# Altium schematic sheet Indication.SchDoc
size 420 x 297 mm; Address1: Address1; Address2: Address2; Address3: Address3; Address4: Address4; DocumentNumber: *Э3; SheetNumber: 7; SheetTotal: 10; DocumentType: Схема электрическая *
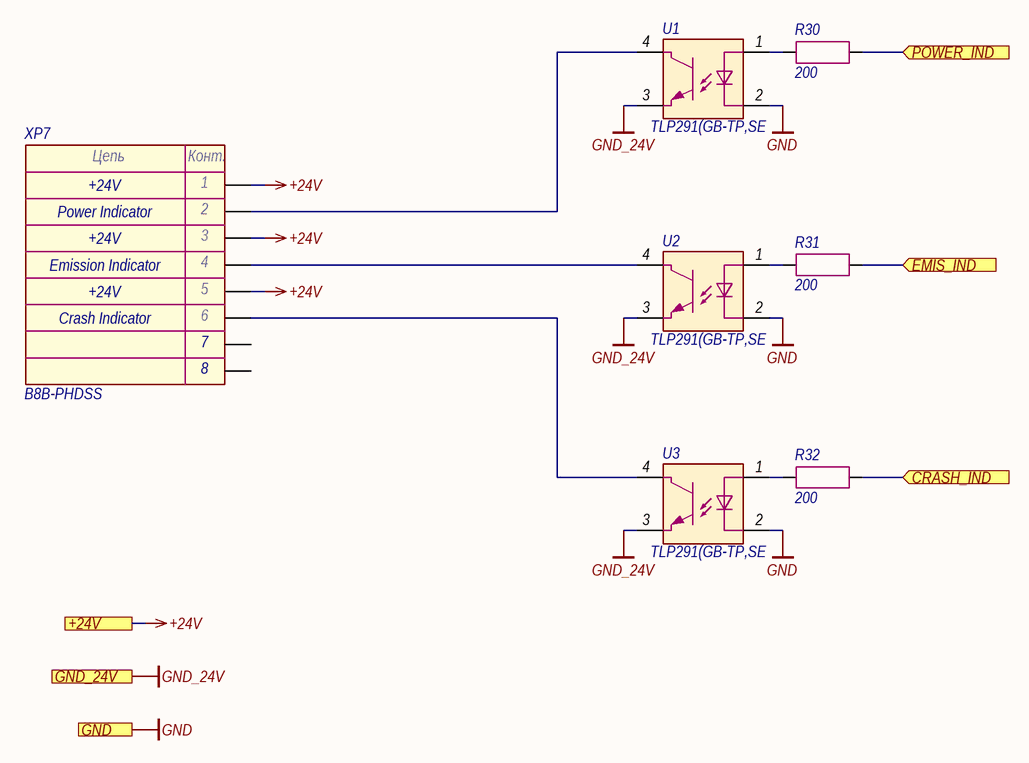
[diagram p0: Indication.SchDoc]

## Parts
R30  200  [RES_0603]
R31  200  [RES_0603]
R32  200  [RES_0603]
U1  TLP291(GB-TP,SE  [11-3C1]
U2  TLP291(GB-TP,SE  [11-3C1]
U3  TLP291(GB-TP,SE  [11-3C1]
XP7  B8B-PHDSS  [B8B-PHDSS]

## Ports
+24V (see Main[2A], Hardwiring[3C], LD_driver[1C], Power_supply[1D]), CRASH_IND (in, see Main[2A]), EMIS_IND (in, see Main[2A]), GND (see Main[2A], Ethernet[3D], Fiber_interlock[2C], Guide_laser[1C], Hardwiring[3D], LD_driver[1D], Power_supply[1D]), GND_24V (see Main[2A], Hardwiring[3C], LD_driver[1D], Power_supply[1D]), POWER_IND (in, see Main[2A])

## Nets
+24V: XP7.1 XP7.3 XP7.5 ; port +24V
GND: U1.2 U2.2 U3.2 ; port GND
GND_24V: U1.3 U2.3 U3.3 ; port GND_24V
CRASH_IND: R32.2 ; port CRASH_IND
EMIS_IND: R31.2 ; port EMIS_IND
POWER_IND: R30.2 ; port POWER_IND
NetR30_1: R30.1 U1.1
NetR31_1: R31.1 U2.1
NetR32_1: R32.1 U3.1
NetU1_4: U1.4 XP7.2
NetU2_4: U2.4 XP7.4
NetU3_4: U3.4 XP7.6

Not connected (* = marked no-connect by the designer): XP7 7 8

## Notes on the sheet
- Power Indicator
- +24V
- (near XP7) Emission Indicator
- Crash Indicator
- Подп. и дата
- Инв. № дубл.
- Взам. инв. №
- Инв. № подл.
- Изм.
- Лист
- № докум.
- Подп.
- Дата
- Копировал
- Формат А3
- (in symbol Connector-8) Цепь; Конт.

## Library data of the parts
R30-R32 = Resistor: Manufacturer: Yageo; Model: RC0603FR-07200RL; Value: 200; Document: *
U1-U3 = TLP291: Manufacturer: Toshiba; Model: TLP291(GB-TP,SE; Document: *
XP7 = Connector-8: Manufacturer: JST; Model: B8B-PHDSS; Document: *